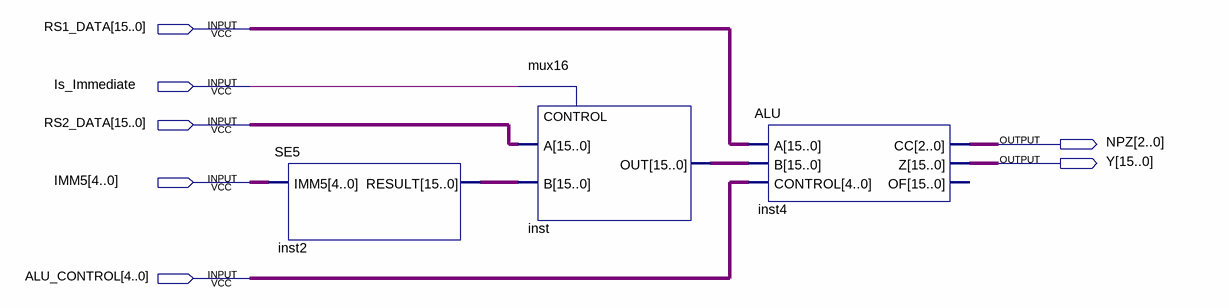
[diagram p0: schematic sheet]
// Quartus schematic Execution.bdf as structural Verilog: 3 symbols, 7 pins
module Execution (
  input  [15:0] RS1_DATA,
  input  Is_Immediate,
  input  [15:0] RS2_DATA,
  input  [4:0] IMM5,
  input  [4:0] ALU_CONTROL,
  output [2:0] NPZ,
  output [15:0] Y
);

  wire [15:0] inst2_result, inst_out;

  SE5 inst2 (.IMM5(IMM5), .RESULT(inst2_result));
  mux16 inst (.A(RS2_DATA), .B(inst2_result), .CONTROL(Is_Immediate), .OUT(inst_out));
  ALU inst4 (.A(RS1_DATA), .B(inst_out), .CONTROL(ALU_CONTROL), .CC(NPZ), .Z(Y));  // open: OF
endmodule
